# Altium schematic sheet SD_CARD.SchDoc: SD Card
size 420 x 297 mm; Date: 2018-12-27; Author: Vitali Tsiukala; DrawnBy: Vitali Tsiukala; Engineer: Vitali Tsiukala; Organization: Trenz Electronic GmbH; DocumentNumber: 13; Revision: 03; SheetNumber: 13; SheetTotal: 37; ModifiedBy: -; CheckedDate: -; Title2: Fast Stabilizer; DivGrp: WUT ISE; Designer: G.Kasprowicz
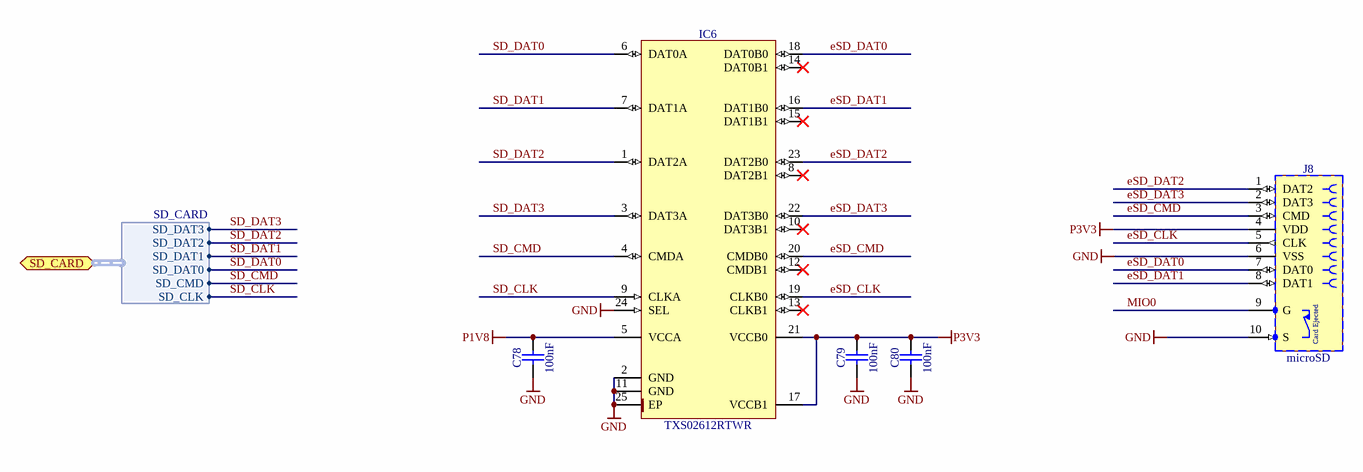
[diagram p0: SD_CARD.SchDoc]

## Parts
C78  100nF  [CAPC1005X55N]
C79  100nF  [CAPC1005X55N]
C80  100nF  [CAPC1005X55N]
IC6  TXS02612RTWR  [QFN50P400X400X80-25N-S255]
J8  microSD  [ATTEND_112A-TAAR-R03]

## Ports
SD_CARD (bidir, harness SD_CARD)

## Harnesses
SD_CARD: SD_DAT3, SD_DAT2, SD_DAT1, SD_DAT0, SD_CMD, SD_CLK

## Nets
GND: C78.1 C79.1 C80.1 IC6.2(GND) IC6.11(GND) IC6.24(SEL) IC6.25(EP) J8.6(VSS) J8.10(S)
P1V8: C78.2 IC6.5(VCCA)
P3V3: C79.2 C80.2 IC6.17(VCCB1) IC6.21(VCCB0) J8.4(VDD)
eSD_CLK: IC6.19(CLKB0) J8.5(CLK)
eSD_CMD: IC6.20(CMDB0) J8.3(CMD)
eSD_DAT0: IC6.18(DAT0B0) J8.7(DAT0)
eSD_DAT1: IC6.16(DAT1B0) J8.8(DAT1)
eSD_DAT2: IC6.23(DAT2B0) J8.1(DAT2)
eSD_DAT3: IC6.22(DAT3B0) J8.2(DAT3)
MIO0: J8.9(G)
SD_CLK: IC6.9(CLKA) ; port SD_CARD.SD_CLK
SD_CMD: IC6.4(CMDA) ; port SD_CARD.SD_CMD
SD_DAT0: IC6.6(DAT0A) ; port SD_CARD.SD_DAT0
SD_DAT1: IC6.7(DAT1A) ; port SD_CARD.SD_DAT1
SD_DAT2: IC6.1(DAT2A) ; port SD_CARD.SD_DAT2
SD_DAT3: IC6.3(DAT3A) ; port SD_CARD.SD_DAT3

Not connected (* = marked no-connect by the designer): IC6 8(DAT2B1)* 10(DAT3B1)* 12(CMDB1)* 13(CLKB1)* 14(DAT0B1)* 15(DAT1B1)*

## Notes on the sheet
- Project/Equipment
- Document
- Designer
- Drawn by
- Check.by
- Copyright WUT ISE 2020.
  This documentation describes Open Hardware and is licensed under the CERN OHL v.1.2. You may redistribute and modify this documentation under the terms of the CERN OHL v.1.2. (http://ohwr.org/CERNOHL). This documentation is distributed WITHOUT ANY EXPRESS OR IMPLIED WARRANTY, INCLUDING OF MERCHANTABILITY, SATISFACTORY QUALITY AND FITNESS FOR A PARTICULAR PURPOSE. Please see the CERN OHL v.1.2 for applicable conditions.
- Contact
- File
- Last Mod.
- Print Date
- Sheet
- Size
- A3
- of
- Rev
- (in symbol ATTEND_112A-TAAR-R03) Card Ejected

## Library data of the parts
C78-C80 = CC0402_100NF_16V_10%_X5R: Non-polarised capacitor; Part Description: SMD Multilayer Chip Ceramic Capacitor; Manufacturer: GENERIC; Manufacturer1 Part Number: GRM155R61C104KA88D; Voltage: 16V; TC: X5R; Tolerance: ±10%; Part Number: CC0402_100NF_16V_10%_X5R; Component Kind: Standard; Component Type: Standard; Pin Count: 2; Value: 100nF; Status: None; Manufacturer Part Number: CC0402_100NF_16V_10%_X5R; Case: 0402; Mounted: Yes; Socket: No; SMD: Yes; Sense: No; Manufacturer1 Example: MURATA; Manufacturer1 ComponentHeight: 0.55mm; HelpURL: \\cern.ch\dfs\Applications\Altium\Datasheets\CC0402_X5R_MURATA_GRM.pdf; Author: CERN DEM JLC; CreateDate: 10.12.2013; LatestRevisionDate: 10.12.2013
IC6 = TXS02612RTWR: SDIO Port Expander With Voltage-Level Translation; Manufacturer: TEXAS INSTRUMENTS; PressFit: No; Bonding: No; Part Number: TXS02612RTWR; Component Kind: Standard; Component Type: Standard; Device: TXS02612RTWR; PackageDescription: QFN, 0.50mm Pitch, Square; 6 Pin X 6 Pin, 4mm X 4mm Body (w/Thermal Tab 2.55 X 2.55 mm), IPC Medium Density; Part Description: SDIO Port Expander With Voltage-Level Translation; Manufacturer Part Number: TXS02612RTWR; Pin Count: 25; Case: QFN24; Mounted: Yes; Socket: No; SMD: Yes; Sense: No; ComponentHeight: 0.8mm; Author: CERN DEM JLC; HelpURL: \\cern.ch\dfs\Applications\Altium\Datasheets\TXS02612RTWR.pdf; CreateDate: 19-Nov-14; LatestRevisionDate: 19-Nov-14
J8 = ATTEND_112A-TAAR-R03: Connector MicroSD 8 Pin + Switch; Part Description: MicroSD Socket, Push-Push Type; Manufacturer: ATTEND; PressFit: No; Part Number: ATTEND_112A-TAAR-R03; Component Kind: Standard; Component Type: Standard; Pin Count: 10; Family: microSD; Mounted: Yes; Socket: No; SMD: Yes; Sense: No; Status: None; Manufacturer Part Number: 112A-TAAR-R03; ComponentHeight: 1.9mm; HelpURL: \\cern.ch\dfs\Applications\Altium\Datasheets\ATTEND_112A-TAAR-R03.pdf; Author: CERN DEM JMW; CreateDate: 07-Jul-15; LatestRevisionDate: 07-Jul-15